# EAGLE schematic Wired_Mouse (EAGLE 9.6.0)
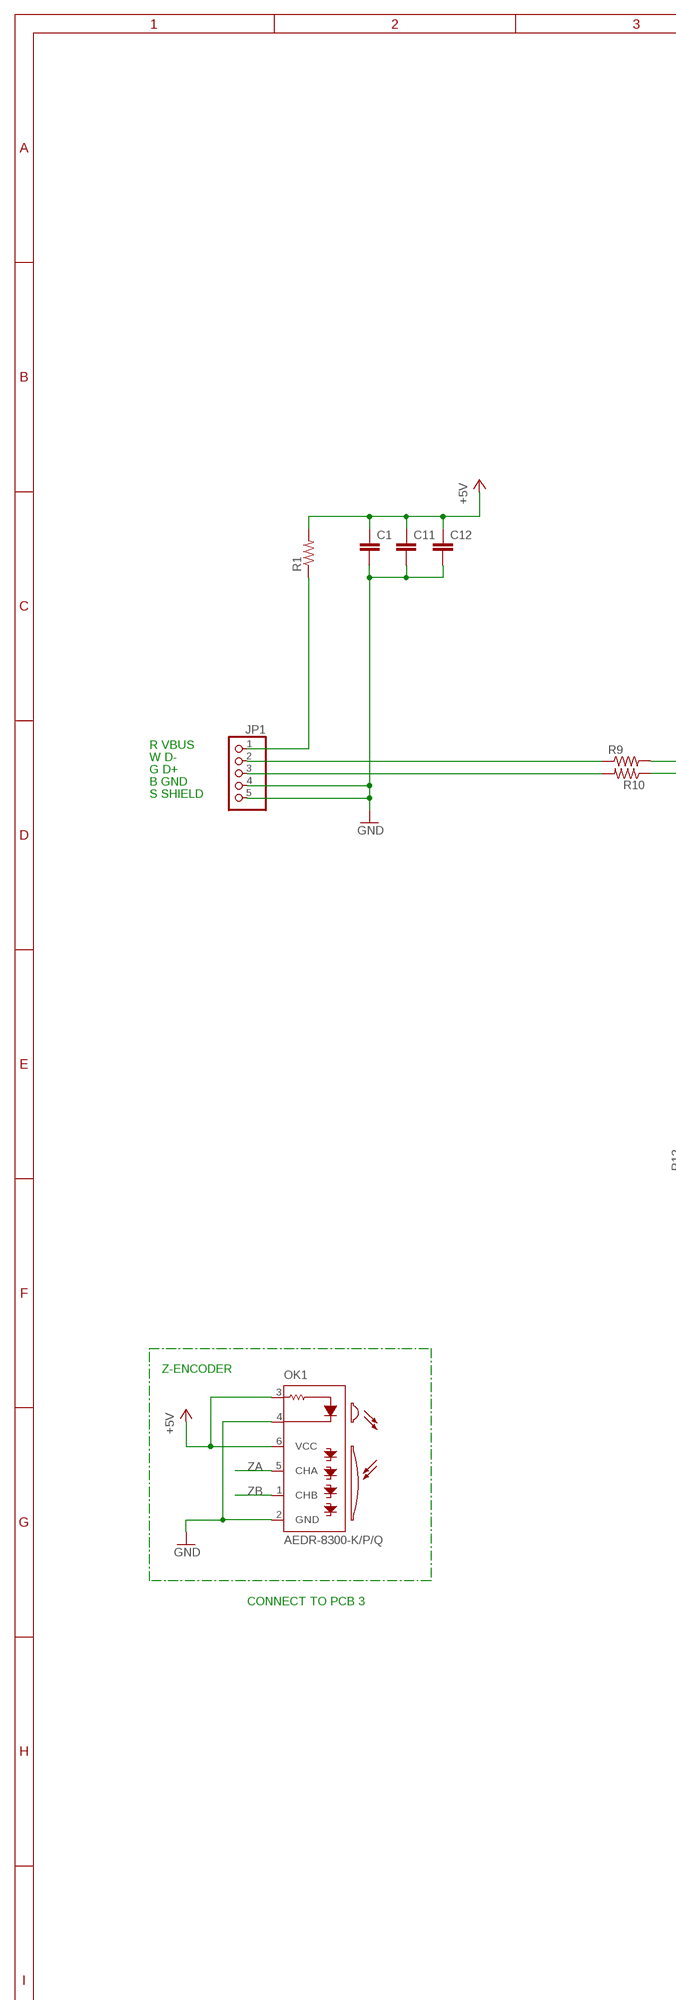
[diagram p0: schematic, sheet 1, part 1 of 2]
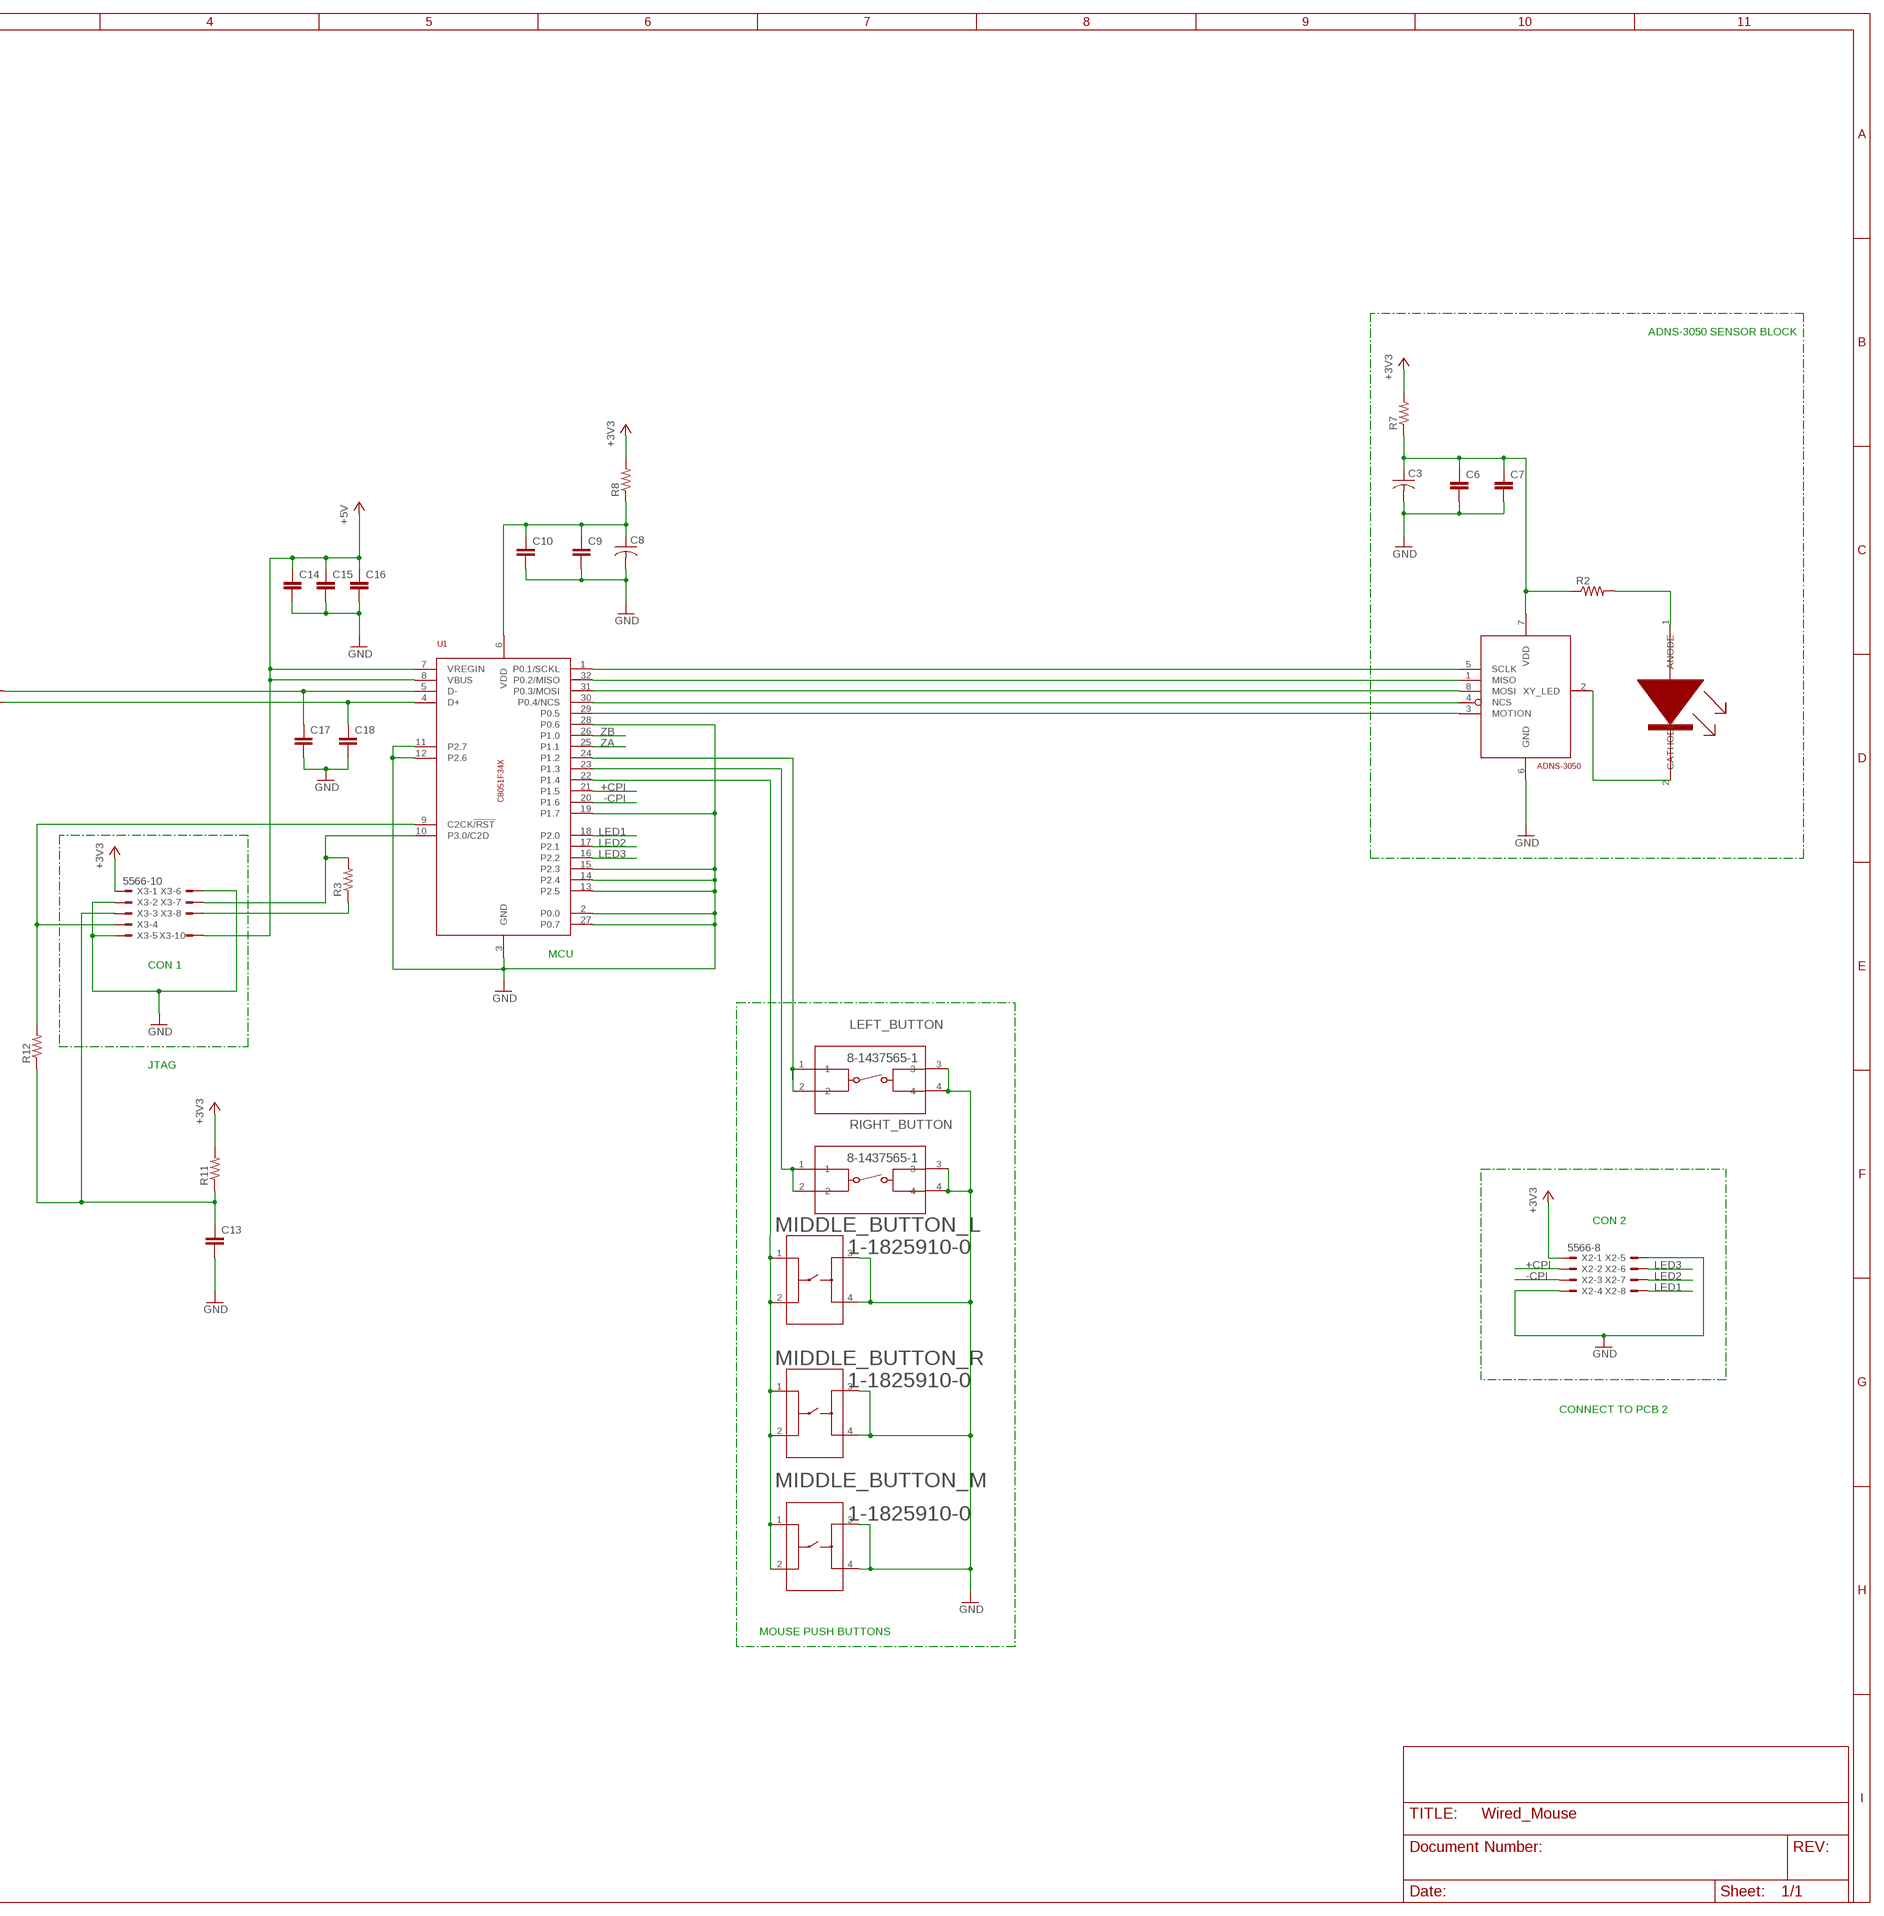
[diagram p1: schematic, sheet 1, part 2 of 2]

## Parts
C1  C-EUC0201  [C0201]
C3  C-US025-025X050  [C025-025X050]
C6  C-EUC0201  [C0201]
C7  C-EUC0201  [C0201]
C8  C-US025-025X050  [C025-025X050]
C9  C-EUC0201  [C0201]
C10  C-EUC0201  [C0201]
C11  C-EUC0201  [C0201]
C12  C-EUC0201  [C0201]
C13  C-EUC0201  [C0201]
C14  C-EUC0201  [C0201]
C15  C-EUC0201  [C0201]
C16  C-EUC0201  [C0201]
C17  C-EUC0201  [C0201]
C18  C-EUC0201  [C0201]
JP1  PINHD-1X5/90  [1X05/90]
LEFT_BUTTON  8-1437565-1  [SW4_1437565]
MIDDLE_BUTTON_L  1-1825910-0  [SWITCH_1-1825910-0]
MIDDLE_BUTTON_M  1-1825910-0  [SWITCH_1-1825910-0]
MIDDLE_BUTTON_R  1-1825910-0  [SWITCH_1-1825910-0]
OK1  AEDR-8300-K/P/Q  [AEDR-8300]
R1  R-US_0204/7  [0204/7]
R2  R-US_0204/7  [0204/7]
R3  R-US_0204/7  [0204/7]
R7  R-US_0204/7  [0204/7]
R8  R-US_0204/7  [0204/7]
R9  R-US_0204/7  [0204/7]
R10  R-US_0204/7  [0204/7]
R11  R-US_0204/7  [0204/7]
R12  R-US_0204/7  [0204/7]
RIGHT_BUTTON  8-1437565-1  [SW4_1437565]
U$1  ADNS_3050THROUGH_HOLE  [DIP1279W50P200L985H450Q8B]
U$2  C8051F34XSURFACE-MOUNT  [QFP80P900X900X160-32N]
U$3  HLMP-EGXX_LEDTHROUGH_HOLE  [LEDRD254W50D500H871B]
X2  5566-8  [5566-8]
X3  5566-10  [5566-10]

## Nets
5V: JP1.1 R1.1
+3V3: R7.2 R8.2 R11.2 X2.1 X3.1
+5V: C1.1 C11.1 C12.1 C14.1 C15.1 C16.1 OK1.3(A) OK1.6(VCC) R1.2 U$2.7(VREGIN) U$2.8(VBUS) X3.10
+CPI: U$2.21(P1.5) X2.2
-CPI: U$2.20(P1.6) X2.3
GND: C1.2 C3.2 C6.2 C7.2 C8.2 C9.2 C10.2 C11.2 C12.2 C13.2 C14.2 C15.2 C16.2 C17.2 C18.2 JP1.4 JP1.5 LEFT_BUTTON.3 LEFT_BUTTON.4 MIDDLE_BUTTON_L.3 MIDDLE_BUTTON_L.4 MIDDLE_BUTTON_M.3 MIDDLE_BUTTON_M.4 MIDDLE_BUTTON_R.3 MIDDLE_BUTTON_R.4 OK1.2(GND) OK1.4(C) RIGHT_BUTTON.3 RIGHT_BUTTON.4 U$1.6(GND) U$2.2(P0.0) U$2.3(GND) U$2.11(P2.7) U$2.12(P2.6) U$2.13(P2.5) U$2.14(P2.4) U$2.15(P2.3) U$2.19(P1.7) U$2.27(P0.7) U$2.28(P0.6) X2.4 X2.5 X3.2 X3.5 X3.6
LED1: U$2.18(P2.0) X2.8
LED2: U$2.17(P2.1) X2.7
LED3: U$2.16(P2.2) X2.6
N$1: U$1.5(SCLK) U$2.1(P0.1/SCKL)
N$2: U$1.1(MISO) U$2.32(P0.2/MISO)
N$3: U$1.8(MOSI) U$2.31(P0.3/MOSI)
N$4: U$1.4(NCS) U$2.30(P0.4/NCS)
N$5: U$1.3(MOTION) U$2.29(P0.5)
N$6: C8.1 C9.1 C10.1 R8.1 U$2.6(VDD)
N$7: R2.2 U$3.1(ANODE)
N$8: U$1.2(XY_LED) U$3.2(CATHODE)
N$10: C3.1 C6.1 C7.1 R2.1 R7.1 U$1.7(VDD)
N$11: LEFT_BUTTON.1 LEFT_BUTTON.2 U$2.24(P1.2)
N$12: RIGHT_BUTTON.1 RIGHT_BUTTON.2 U$2.23(P1.3)
N$15: JP1.2 R9.1
N$16: MIDDLE_BUTTON_L.1 MIDDLE_BUTTON_L.2 MIDDLE_BUTTON_M.1 MIDDLE_BUTTON_M.2 MIDDLE_BUTTON_R.1 MIDDLE_BUTTON_R.2 U$2.22(P1.4)
N$17: JP1.3 R10.2
N$18: C17.1 R9.2 U$2.5(D-)
N$19: C18.1 R10.1 U$2.4(D+)
N$20: R3.1 X3.8
N$21: R3.2 U$2.10(P3.0/C2D) X3.7
N$23: R12.2 U$2.9(C2CK!/RST) X3.4
N$24: C13.1 R11.1 R12.1 X3.3
ZA: OK1.5(CHA) U$2.25(P1.1)
ZB: OK1.1(CHB) U$2.26(P1.0)
Unconnected: X3.9

## Notes on the sheet
- ADNS-3050 SENSOR BLOCK
- R VBUS
- W D-
- G D+
- B GND
- S SHIELD
- MCU
- CON 1
- JTAG
- CON 2
- Z-ENCODER
- CONNECT TO PCB 2
- CONNECT TO PCB 3
- MOUSE PUSH BUTTONS

## Power pins joined to a net without a drawn wire
GND: OK1.E1(GND) OK1.E2(GND)

## Library data of the parts
C1 C6 C7 C9-C18 = rcl:C-EU: CAPACITOR, European symbol; SPICEPREFIX: C
C3 C8 = rcl:C-US: CAPACITOR, American symbol; SPICEPREFIX: C
JP1 = pinhead:PINHD-1X5: PIN HEADER; SPICEPREFIX: X
LEFT_BUTTON RIGHT_BUTTON = Switches:8-1437565-1; BUILT_BY: EMA_UL_Team; CATEGORY: Tactile Switches; CONFIGURATION__POLE-THROW_: Single Pole - Single Throw; COPYRIGHT: Copyright (C) 2016 Accelerated Designs. All rights reserved; DESCRIPTION: FSMCTATR=TACTILE SWITCH T&R; MANUFACTURER_PART_NUMBER: 8-1437565-1; MAX_SWITCHING_CURRENT: -; MAX_SWITCHING_VOLTAGE_AC_: -; PART_STATUS: active; PRODUCT_TYPE: Switch; SERIES: Unknown; SWITCH_TYPE: Tactile Switches; TE_PART_NUMBER: 8-1437565-1; VENDOR: TE Connectivity
MIDDLE_BUTTON_L MIDDLE_BUTTON_M MIDDLE_BUTTON_R = Switches:1-1825910-0; BUILT_BY: EMA_UL_Team; CATEGORY: Tactile Switches; COPYRIGHT: Copyright (C) 2016 Accelerated Designs. All rights reserved; DESCRIPTION: FSM6JH=6MM TACT SWITCH, HIGH TEMP; MANUFACTURER_PART_NUMBER: 1-1825910-0; PART_STATUS: active; SERIES: Unknown; VENDOR: TE Connectivity
OK1 = optocoupler:AEDR-8300-K: Agilent AEDR-8300 Series Encoders Reflective Surface Mount Optical Encoder Source: http: http://www.avagotech.com .. AV02-0088EN-1.pdf; MF: AGILENT TECHNOLOGIES; MPN: AEDR-8300-1P2; OC_FARNELL: 1161102; OC_NEWARK: 08J1020; SPICEPREFIX: X
R1-R3 R7-R12 = rcl:R-US_: RESISTOR, American symbol; SPICEPREFIX: R
U$1 = Custom_Mouse:ADNS_3050: ADNS-3050 is a small form factor entry-level gaming optical navigation sensor. It is housed in a dual in-line package (DIP). ADNS-3050 along with ADNS-5200 clip, and HLMP_EG3E red LED form a complete and compact mouse tracking system.; SPICEPREFIX: X
U$2 = Custom_Mouse:C8051F34X: C8051F340/1/2/3/4/5/6/7/8/9/A/B/C/D devices are fully integrated mixed-signal System-on-a-Chip MCUs. It is 32-pin LQFP package.; SPICEPREFIX: X
U$3 = Custom_Mouse:HLMP-EGXX_LED: AlInGaP LED technology provides extremely stable light output over long periods of time. Precision Optical Performance lamps utilize the aluminum indium gallium phosphide (AlInGaP) technology.; SPICEPREFIX: B
X2 = con-molex:5566-8: Mini FIT connector 8 pol Source: http://www.molex.com; MF: MOLEX; OC_FARNELL: unknown; OC_NEWARK: unknown; SPICEPREFIX: X
X3 = con-molex:5566-10: Mini FIT connector 10 pol Source: http://www.molex.com; MF: MOLEX; OC_FARNELL: unknown; OC_NEWARK: unknown; SPICEPREFIX: X